# Altium schematic sheet Line_Follower_v5.SchDoc: General View
size A4 portrait; Autor: Teodor; Dopisek: Cel:; Cel: Ehh; Projektant: Teodor
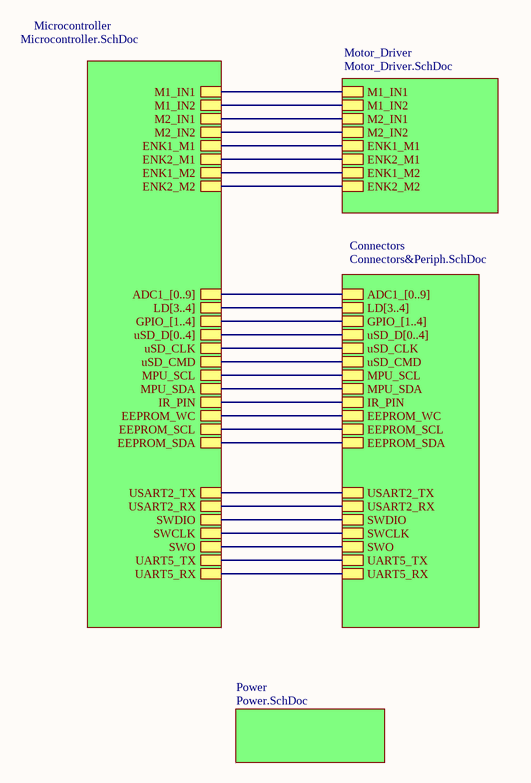
[diagram p0: Line_Follower_v5.SchDoc]

## Sub-sheets
Connectors = Connectors&Periph.SchDoc: ADC1_[0..9], LD[3..4], GPIO_[1..4], uSD_D[0..4], uSD_CLK, uSD_CMD, MPU_SCL, MPU_SDA, IR_PIN, EEPROM_WC, EEPROM_SCL, EEPROM_SDA, USART2_TX, USART2_RX, SWDIO, SWCLK, SWO, UART5_TX, UART5_RX
Microcontroller = Microcontroller.SchDoc: M1_IN1, M1_IN2, M2_IN1, M2_IN2, ENK1_M1, ENK2_M1, ENK1_M2, ENK2_M2, ADC1_[0..9], LD[3..4], GPIO_[1..4], uSD_D[0..4], uSD_CLK, uSD_CMD, MPU_SCL, MPU_SDA, IR_PIN, EEPROM_WC, EEPROM_SCL, EEPROM_SDA, USART2_TX, USART2_RX, SWDIO, SWCLK, SWO, UART5_TX, UART5_RX
Motor_Driver = Motor_Driver.SchDoc: M1_IN1, M1_IN2, M2_IN1, M2_IN2, ENK1_M1, ENK2_M1, ENK1_M2, ENK2_M2
Power = Power.SchDoc: no entries

## Nets
(unnamed): sheet Connectors/uSD_CLK, sheet Microcontroller/uSD_CLK
(unnamed): sheet Connectors/uSD_CMD, sheet Microcontroller/uSD_CMD
(unnamed): sheet Connectors/MPU_SCL, sheet Microcontroller/MPU_SCL
(unnamed): sheet Connectors/MPU_SDA, sheet Microcontroller/MPU_SDA
(unnamed): sheet Connectors/IR_PIN, sheet Microcontroller/IR_PIN
(unnamed): sheet Connectors/EEPROM_WC, sheet Microcontroller/EEPROM_WC
(unnamed): sheet Connectors/EEPROM_SCL, sheet Microcontroller/EEPROM_SCL
(unnamed): sheet Connectors/EEPROM_SDA, sheet Microcontroller/EEPROM_SDA
(unnamed): sheet Connectors/USART2_TX, sheet Microcontroller/USART2_TX
(unnamed): sheet Connectors/USART2_RX, sheet Microcontroller/USART2_RX
(unnamed): sheet Connectors/SWDIO, sheet Microcontroller/SWDIO
(unnamed): sheet Connectors/SWCLK, sheet Microcontroller/SWCLK
(unnamed): sheet Connectors/SWO, sheet Microcontroller/SWO
(unnamed): sheet Connectors/UART5_TX, sheet Microcontroller/UART5_TX
(unnamed): sheet Connectors/UART5_RX, sheet Microcontroller/UART5_RX
(unnamed): sheet Motor_Driver/M1_IN1, sheet Microcontroller/M1_IN1
(unnamed): sheet Motor_Driver/M1_IN2, sheet Microcontroller/M1_IN2
(unnamed): sheet Motor_Driver/M2_IN1, sheet Microcontroller/M2_IN1
(unnamed): sheet Motor_Driver/M2_IN2, sheet Microcontroller/M2_IN2
(unnamed): sheet Motor_Driver/ENK1_M1, sheet Microcontroller/ENK1_M1
(unnamed): sheet Motor_Driver/ENK2_M1, sheet Microcontroller/ENK2_M1
(unnamed): sheet Motor_Driver/ENK1_M2, sheet Microcontroller/ENK1_M2
(unnamed): sheet Motor_Driver/ENK2_M2, sheet Microcontroller/ENK2_M2

## Buses and harness runs
bus sheet Connectors/ADC1_[0..9] = sheet Microcontroller/ADC1_[0..9]
bus sheet Connectors/GPIO_[1..4] = sheet Microcontroller/GPIO_[1..4]
bus sheet Connectors/LD[3..4] = sheet Microcontroller/LD[3..4]
bus sheet Connectors/uSD_D[0..4] = sheet Microcontroller/uSD_D[0..4]

## Notes on the sheet
- Tytuł:
- Rozmiar:
- Data:
- A4
- Designed by:
- Czas:
- Część
- z